# Altium schematic sheet Main.SchDoc
size A4
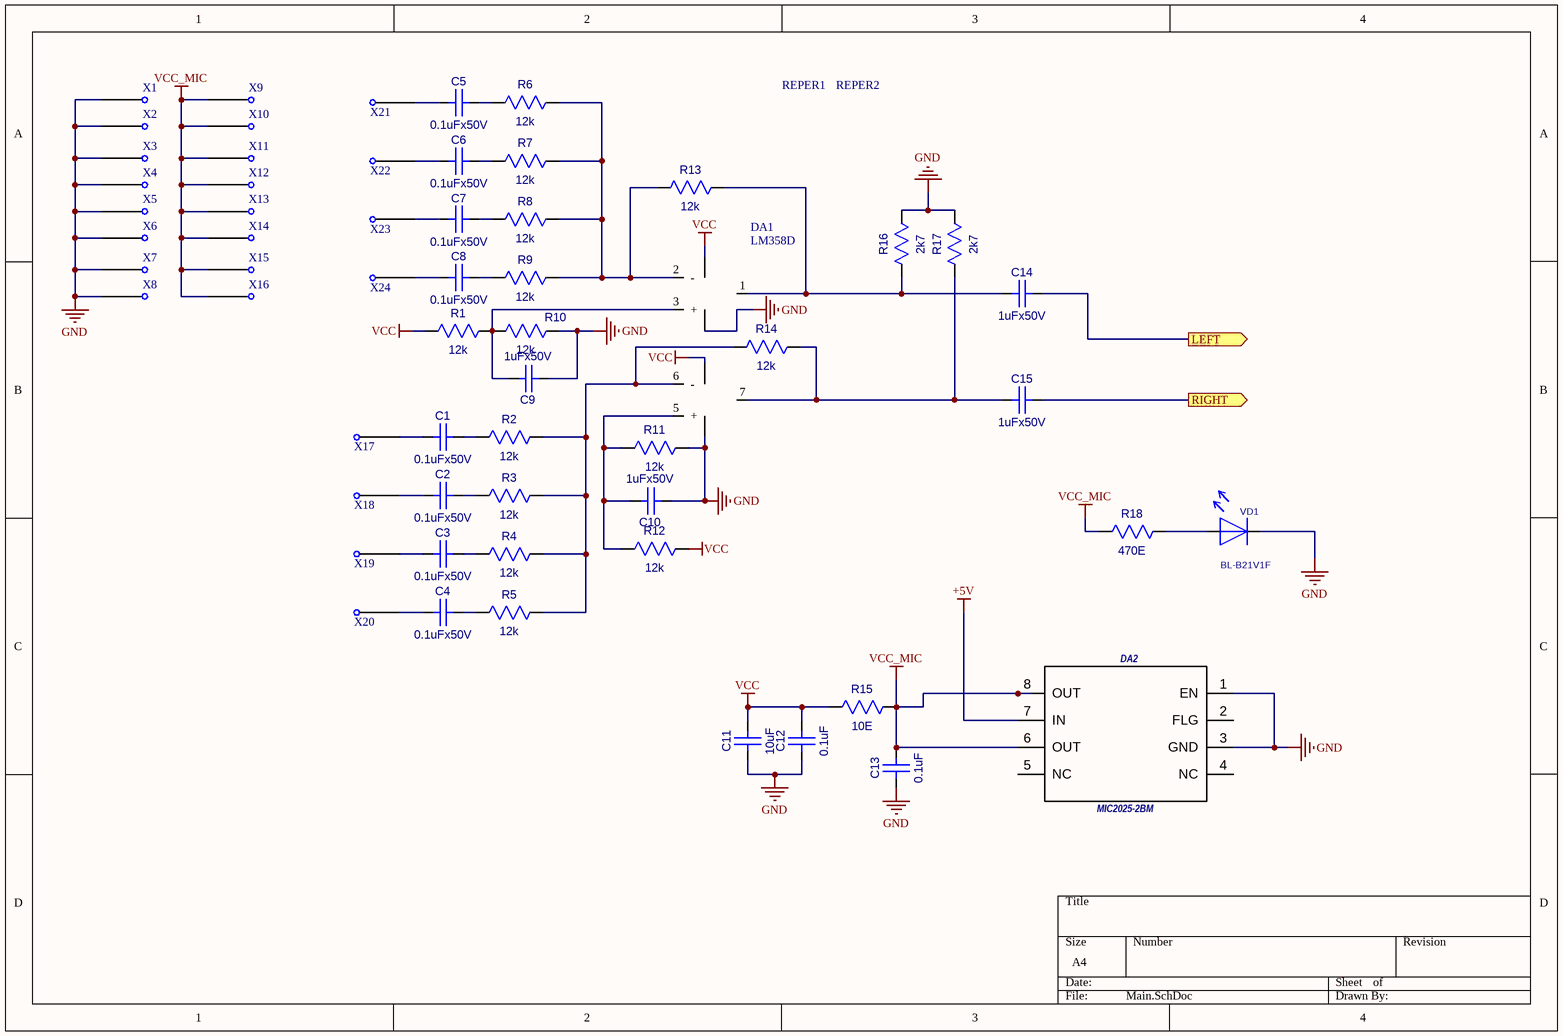
[diagram p0: Main.SchDoc]

## Parts
C1  0.1uFx50V  [CC0603-3M]
C2  0.1uFx50V  [CC0603-3M]
C3  0.1uFx50V  [CC0603-3M]
C4  0.1uFx50V  [CC0603-3M]
C5  0.1uFx50V  [CC0603-3M]
C6  0.1uFx50V  [CC0603-3M]
C7  0.1uFx50V  [CC0603-3M]
C8  0.1uFx50V  [CC0603-3M]
C9  1uFx50V  [CC0603-3M]
C10  1uFx50V  [CC0603-3M]
C11  10uF  [CC0805-MIDI-2M1]
C12  0.1uF  [CC0603-3M]
C13  0.1uF  [CC0603-3M]
C14  1uFx50V  [CC0603-3M]
C15  1uFx50V  [CC0603-3M]
DA1  LM358D  [SO-8]
DA2  MIC2025-2BM  [SO-8]
R1  12k  [RC0603-3M]
R2  12k  [RC0603-3M]
R3  12k  [RC0603-3M]
R4  12k  [RC0603-3M]
R5  12k  [RC0603-3M]
R6  12k  [RC0603-3M]
R7  12k  [RC0603-3M]
R8  12k  [RC0603-3M]
R9  12k  [RC0603-3M]
R10  12k  [RC0603-3M]
R11  12k  [RC0603-3M]
R12  12k  [RC0603-3M]
R13  12k  [RC0603-3M]
R14  12k  [RC0603-3M]
R15  10E  [RC0805_IPC_NOM]
R16  2k7  [RC0603-3M]
R17  2k7  [RC0603-3M]
R18  470E  [RC0603-3M]
REPER1  REPER1.2  [REPER1.2]  (value not drawn)
REPER2  REPER1.2  [REPER1.2]  (value not drawn)
VD1  BL-B21V1F  [LED3]
X1  PIN_1mm  [PIN_1mm]  (value not drawn)
X2  PIN_1mm  [PIN_1mm]  (value not drawn)
X3  PIN_1mm  [PIN_1mm]  (value not drawn)
X4  PIN_1mm  [PIN_1mm]  (value not drawn)
X5  PIN_1mm  [PIN_1mm]  (value not drawn)
X6  PIN_1mm  [PIN_1mm]  (value not drawn)
X7  PIN_1mm  [PIN_1mm]  (value not drawn)
X8  PIN_1mm  [PIN_1mm]  (value not drawn)
X9  PIN_1mm  [PIN_1mm]  (value not drawn)
X10  PIN_1mm  [PIN_1mm]  (value not drawn)
X11  PIN_1mm  [PIN_1mm]  (value not drawn)
X12  PIN_1mm  [PIN_1mm]  (value not drawn)
X13  PIN_1mm  [PIN_1mm]  (value not drawn)
X14  PIN_1mm  [PIN_1mm]  (value not drawn)
X15  PIN_1mm  [PIN_1mm]  (value not drawn)
X16  PIN_1mm  [PIN_1mm]  (value not drawn)
X17  PIN_1mm  [PIN_1mm]  (value not drawn)
X18  PIN_1mm  [PIN_1mm]  (value not drawn)
X19  PIN_1mm  [PIN_1mm]  (value not drawn)
X20  PIN_1mm  [PIN_1mm]  (value not drawn)
X21  PIN_1mm  [PIN_1mm]  (value not drawn)
X22  PIN_1mm  [PIN_1mm]  (value not drawn)
X23  PIN_1mm  [PIN_1mm]  (value not drawn)
X24  PIN_1mm  [PIN_1mm]  (value not drawn)

## Ports
LEFT (out), RIGHT (out)

## Nets
+5V: DA2.7(IN)
GND: C9.1(A) C10.1(A) C11.1(A) C12.1(A) C13.1(A) DA1.4(Vss) DA2.1(EN) DA2.3(GND) R10.2(B) R11.2(B) R16.2(B) R17.2(B) VD1.1 X1.1 X2.1 X3.1 X4.1 X5.1 X6.1 X7.1 X8.1
VCC: C11.2(B) C12.2(B) DA1.8(Vdd) R1.1(A) R12.2(B) R15.1(A)
VCC_MIC: C13.2(B) DA2.6(OUT) DA2.8(OUT) R15.2(B) R18.1(A) X9.1 X10.1 X11.1 X12.1 X13.1 X14.1 X15.1 X16.1
LEFT: C14.2(B) ; port LEFT
RIGHT: C15.2(B) ; port RIGHT
NetC1_1: C1.1(A) X17.1
NetC1_2: C1.2(B) R2.1(A)
NetC2_1: C2.1(A) X18.1
NetC2_2: C2.2(B) R3.1(A)
NetC3_1: C3.1(A) X19.1
NetC3_2: C3.2(B) R4.1(A)
NetC4_1: C4.1(A) X20.1
NetC4_2: C4.2(B) R5.1(A)
NetC5_1: C5.1(A) X21.1
NetC5_2: C5.2(B) R6.1(A)
NetC6_1: C6.1(A) X22.1
NetC6_2: C6.2(B) R7.1(A)
NetC7_1: C7.1(A) X23.1
NetC7_2: C7.2(B) R8.1(A)
NetC8_1: C8.1(A) X24.1
NetC8_2: C8.2(B) R9.1(A)
NetC9_2: C9.2(B) DA1.3(+) R1.2(B) R10.1(A)
NetC10_2: C10.2(B) DA1.5(+) R11.1(A) R12.1(A)
NetC14_1: C14.1(A) DA1.1(Out1) R13.2(B) R16.1(A)
NetC15_1: C15.1(A) DA1.7(Out2) R14.2(B) R17.1(A)
NetDA1_2: DA1.2(-) R6.2(B) R7.2(B) R8.2(B) R9.2(B) R13.1(A)
NetDA1_6: DA1.6(-) R2.2(B) R3.2(B) R4.2(B) R5.2(B) R14.1(A)
NetR18_2: R18.2(B) VD1.2

Not connected (* = marked no-connect by the designer): DA2 2(FLG) 4(NC) 5(NC); REPER1 1; REPER2 1

## Library data of the parts
C1-C10 C14 C15 = CC0603: CC0603 X7R
  C1-C8: Value: 0.1uFx50V
  C9 C10 C14 C15: Value: 1uFx50V
C11 = CC0805: Value: 10uF
C12 C13 = CC0603: Value: 0.1uF
R1-R14 R16-R18 = RC0603
  R1-R14: Value: 12k
  R16 R17: Value: 2k7
  R18: Value: 470E
R15 = RC0805: Value: 10E
VD1 = LED_3: Value: BL-B21V1F
DA1 = LM358D: Value: LM358D
DA2 = MIC2025-2BM: Value: *
REPER1 REPER2 = REPER1.2: Value: *